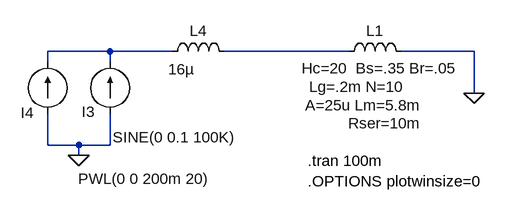
[diagram p0: schematic Fig_2-114_Inductor_Satulation_BH.asc]
Fig_2-114_Inductor_Satulation_BH.asc, the LTspice schematic file:
Version 4
SHEET 1 880 680
WIRE -336 256 -432 256
WIRE -240 256 -336 256
WIRE 32 256 -160 256
WIRE 224 256 112 256
WIRE -432 272 -432 256
WIRE -336 272 -336 256
WIRE 224 320 224 256
WIRE -432 400 -432 352
WIRE -384 400 -432 400
WIRE -336 400 -336 352
WIRE -336 400 -384 400
WIRE -384 416 -384 400
FLAG 224 320 0
FLAG -384 416 0
SYMBOL ind -256 272 R270
WINDOW 0 32 56 VTop 2
WINDOW 3 4 30 VBottom 2
WINDOW 39 -24 86 VBottom 2
SYMATTR InstName L4
SYMATTR Value 16µ
SYMBOL current -336 352 R180
WINDOW 0 23 3 Left 2
WINDOW 3 -193 -36 Left 2
WINDOW 123 0 0 Left 2
WINDOW 39 0 0 Left 2
SYMATTR InstName I3
SYMATTR Value SINE(0 0.1 100K)
SYMBOL current -432 352 R180
WINDOW 0 21 2 Left 2
WINDOW 3 -250 -100 Left 2
WINDOW 123 0 0 Left 2
WINDOW 39 0 0 Left 2
SYMATTR InstName I4
SYMATTR Value PWL(0 0 200m 20)
SYMBOL ind 16 272 R270
WINDOW 123 -51 38 VBottom 2
WINDOW 39 -23 28 VBottom 2
WINDOW 40 -79 71 VBottom 2
WINDOW 0 32 56 VTop 2
WINDOW 3 6 62 VBottom 2
SYMATTR Value2 A=25u Lm=5.8m
SYMATTR SpiceLine Lg=.2m N=10
SYMATTR SpiceLine2 Rser=10m
SYMATTR InstName L1
SYMATTR Value Hc=20  Bs=.35 Br=.05
TEXT -32 424 Left 2 !.tran 100m
TEXT -32 456 Left 2 !.OPTIONS plotwinsize=0

The netlist it stands for:
* Fig_2-114_Inductor_Satulation_BH.asc
L4 N001 N002 16µ
I3 0 N001 SINE(0 0.1 100K)
I4 0 N001 PWL(0 0 200m 20)
L1 N002 0 Hc=20  Bs=.35 Br=.05 A=25u Lm=5.8m Lg=.2m N=10 Rser=10m
.tran 100m
.OPTIONS plotwinsize=0
.backanno
.end